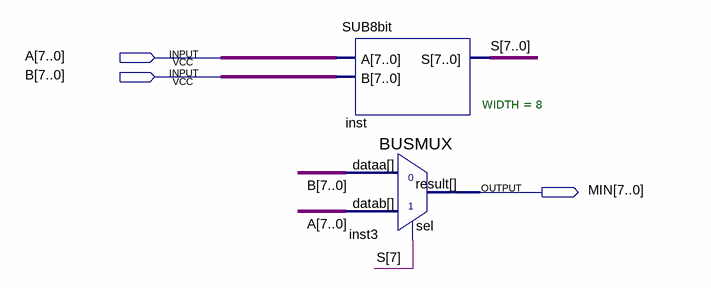
[diagram p0: schematic sheet]
// Quartus schematic MIN.bdf as structural Verilog: 2 symbols, 3 pins
module MIN (
  input  [7:0] A,
  input  [7:0] B,
  output [7:0] MIN
);

  wire [7:0] S;

  SUB8bit inst (.A(A), .B(B), .S(S));
  BUSMUX #(.WIDTH(8)) inst3 (.datab(A), .sel(S[7]), .dataa(B), .result(MIN));
endmodule
